# EAGLE design Schematic (EAGLE 9.5.0)
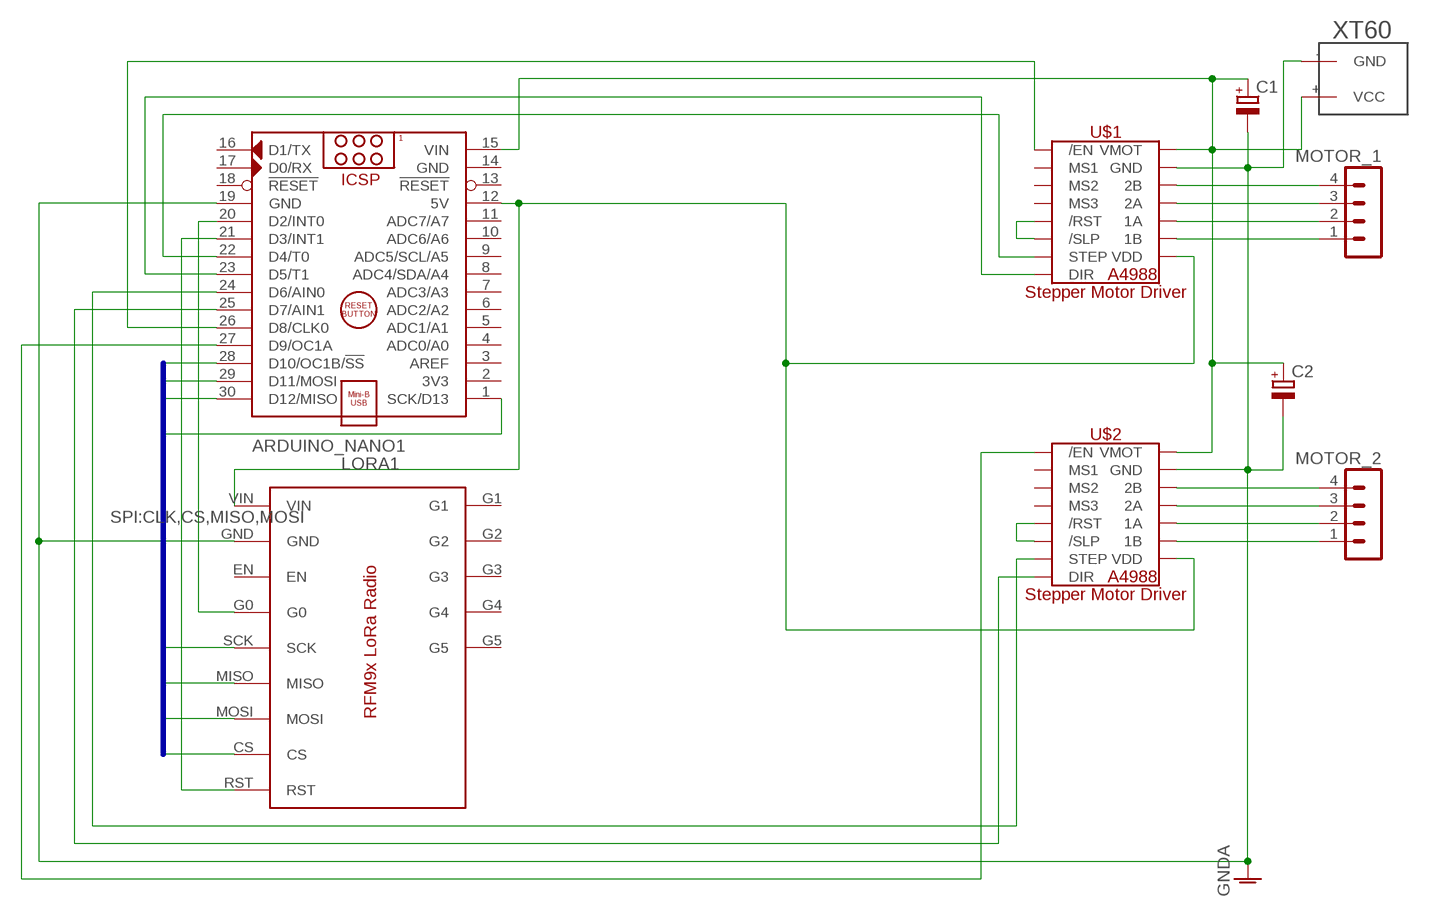
[diagram p0: schematic, sheet 1]

## Parts
ARDUINO_NANO1  ARDUINO_NANO  [ARDUINO_NANO]
C1  CPOL-EUE2,5-6E  [E2,5-6E]
C2  CPOL-EUE2,5-6E  [E2,5-6E]
LORA1  RFM9X_LORA  [RFM9X_LORA]
MOTOR_1  MA04-1  [MA04-1]
MOTOR_2  MA04-1  [MA04-1]
U$1  A4988_STEP  [A4988_STEP]
U$2  A4988_STEP  [A4988_STEP]
U$3  XT60_XT60  [XT60_XT60]

## Nets
CLK: ARDUINO_NANO1.1(SCK/D13) LORA1.SCK
CS: ARDUINO_NANO1.28(D10/OC1B/!SS) LORA1.CS
GNDA: ARDUINO_NANO1.19(GND) C1.- C2.- LORA1.GND U$1.GND U$1.GND2(GND) U$2.GND U$2.GND2(GND) U$3.-(GND)
MISO: ARDUINO_NANO1.30(D12/MISO) LORA1.MISO
MOSI: ARDUINO_NANO1.29(D11/MOSI) LORA1.MOSI
N$1: ARDUINO_NANO1.21(D3/INT1) LORA1.RST
N$2: ARDUINO_NANO1.20(D2/INT0) LORA1.G0
N$3: ARDUINO_NANO1.12(5V) LORA1.VIN U$1.VDD U$2.VDD
N$4: ARDUINO_NANO1.26(D8/CLK0) U$1./EN
N$5: U$1./RST U$1./SLP
N$6: U$2./RST U$2./SLP
N$7: ARDUINO_NANO1.22(D4/T0) U$1.STEP
N$8: ARDUINO_NANO1.23(D5/T1) U$1.DIR
N$9: ARDUINO_NANO1.24(D6/AIN0) U$2.STEP
N$10: ARDUINO_NANO1.25(D7/AIN1) U$2.DIR
N$11: ARDUINO_NANO1.15(VIN) C1.+ C2.+ U$1.VMOT U$2.VMOT U$3.+(VCC)
N$12: ARDUINO_NANO1.27(D9/OC1A) U$2./EN
N$15: MOTOR_1.4 U$1.2B
N$16: MOTOR_1.3 U$1.2A
N$17: MOTOR_1.2 U$1.1A
N$18: MOTOR_1.1 U$1.1B
N$19: MOTOR_2.4 U$2.2B
N$20: MOTOR_2.3 U$2.2A
N$21: MOTOR_2.2 U$2.1A
N$22: MOTOR_2.1 U$2.1B
Unconnected: ARDUINO_NANO1.2(3V3) ARDUINO_NANO1.3(AREF) ARDUINO_NANO1.4(ADC0/A0) ARDUINO_NANO1.5(ADC1/A1) ARDUINO_NANO1.6(ADC2/A2) ARDUINO_NANO1.7(ADC3/A3) ARDUINO_NANO1.8(ADC4/SDA/A4) ARDUINO_NANO1.9(ADC5/SCL/A5) ARDUINO_NANO1.10(ADC6/A6) ARDUINO_NANO1.11(ADC7/A7) ARDUINO_NANO1.13(!RESET) ARDUINO_NANO1.16(D1/TX) ARDUINO_NANO1.17(D0/RX) ARDUINO_NANO1.18(!RESET) LORA1.EN LORA1.G1 LORA1.G2 LORA1.G3 LORA1.G4 LORA1.G5 U$1.MS1 U$1.MS2 U$1.MS3 U$2.MS1 U$2.MS2 U$2.MS3

## Buses
SPI:CLK,CS,MISO,MOSI

## Power pins joined to a net without a drawn wire
GND: ARDUINO_NANO1.14(GND)

## Library data of the parts
ARDUINO_NANO1 = ArduinoNanoV30:ARDUINO_NANO: Arduino Nano V3.0 Module Overview: The Arduino Nano is a small, complete, and breadboard-friendly board based on the ATmega328 (Arduino Nano 3.x) or ATmega168 (Arduino Nano 2.x). It has more or less the same functionality of the Arduino Duemilanove, but in a different package. It lacks only a DC power jack, and works with a Mini-B USB cable instead of a standard one. The Nano was designed and is being produced by Gravitech <http://www.gravitech.us/arna30wiatp.html>. General specifications: Item Value Microcontroller Atmel ATmega168 or ATmega328 Operating Voltage (logic level) 5 V Input Voltage (recommended) 7-12 V Input Voltage (limits) 6-20 V Digital I/O Pins 14 (of which 6 provide PWM output) Analog Input Pins 8 DC Current per I/O Pin 40 mA Flash Memory 16 KB (ATmega168) or 32 KB (ATmega328) of which 2 KB used by bootloader SRAM 1 KB (ATmega168) or 2 KB (ATmega328) EEPROM 512 bytes (ATmega168) or 1 KB (ATmega328) Clock Speed 16 MHz Dimensions (Inches) 0.73" x 1.70" Dimensions (mm) 18mm x 45mm Overall height About 9 mm (not including pins) Weigth 5 g Power: The Arduino Nano can be powered via the Mini-B USB connection, 6-20V unregulated external power supply (pin 30), or 5V regulated external power supply (pin 27). The power source is automatically selected to the highest voltage source. Memory: The ATmega168 has 16 KB of flash memory for storing code (of which 2 KB is used for the bootloader); the ATmega328 has 32 KB, (also with 2 KB used for the bootloader). The ATmega168 has 1 KB of SRAM and 512 bytes of EEPROM (which can be read and written with the EEPROM library); the ATmega328 has 2 KB of SRAM and 1 KB of EEPROM. Input and Output: Each of the 14 digital pins on the Nano can be used as an input or output, using pinMode(), digitalWrite(), and digitalRead() functions. They operate at 5 volts. Each pin can provide or receive a maximum of 40 mA and has an internal pull-up resistor (disconnected by default) of 20-50 kOhms. In addition, some pins have specialized functions. Visit Arduino - ArduinoBoardNano <https://www.arduino.cc/en/Main/ArduinoBoardNano>
C1 C2 = rcl:CPOL-EU: POLARIZED CAPACITOR, European symbol; SPICEPREFIX: C
LORA1 = RFM9x_LoRa:RFM9X_LORA: RFM9x LoRa Radio Transciever https://learn.adafruit.com/adafruit-rfm69hcw-and-rfm96-rfm95-rfm98-lora-packet-padio-breakouts
MOTOR_1 MOTOR_2 = con-lstb:MA04-1: PIN HEADER; OC_FARNELL: unknown; OC_NEWARK: unknown
U$1 U$2 = IC:A4988_STEP
U$3 = XT60_LipoConnector:XT60_XT60: XT60

## Board
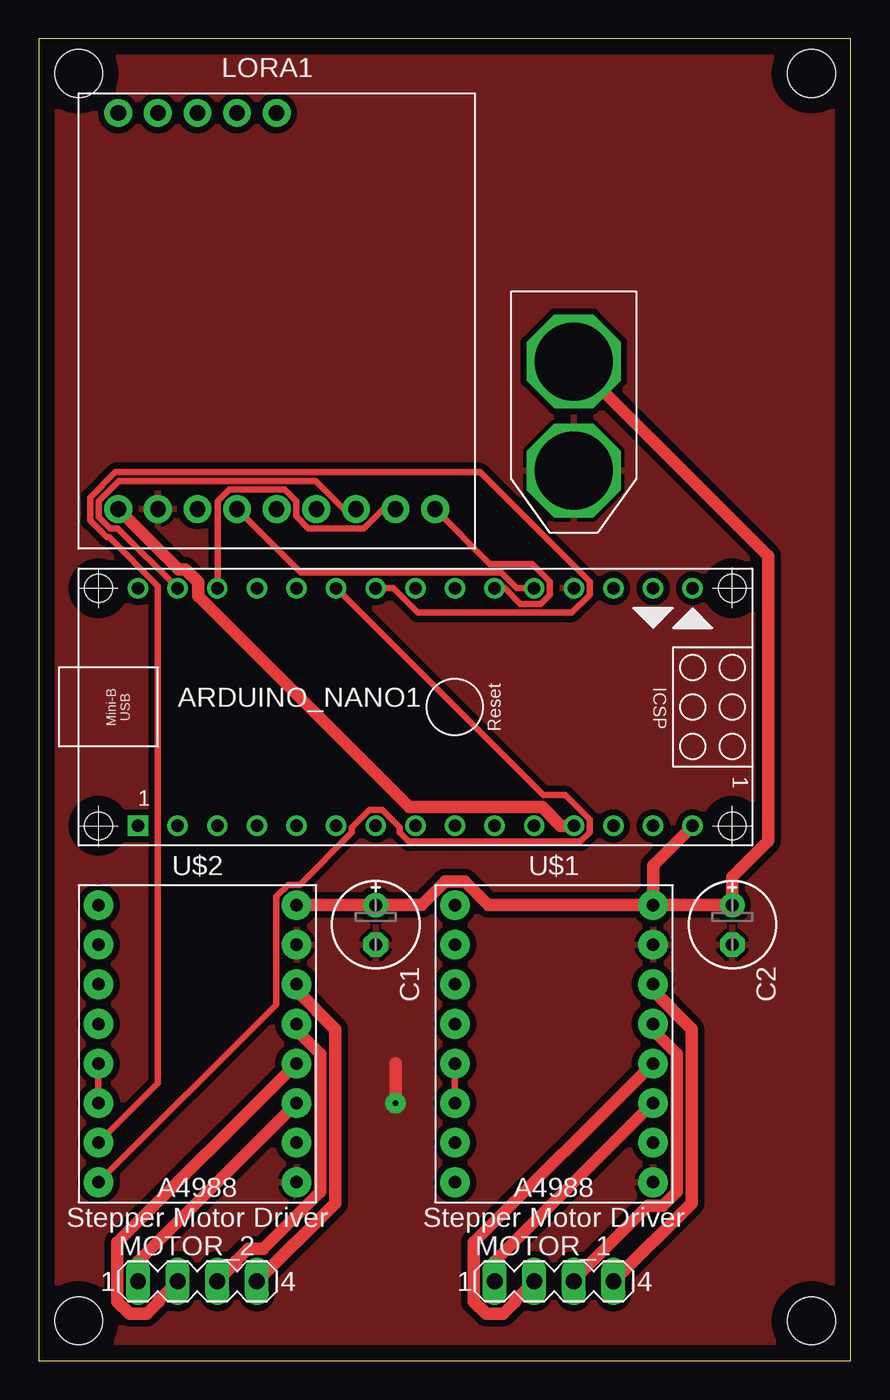
[diagram p1: board, top side]
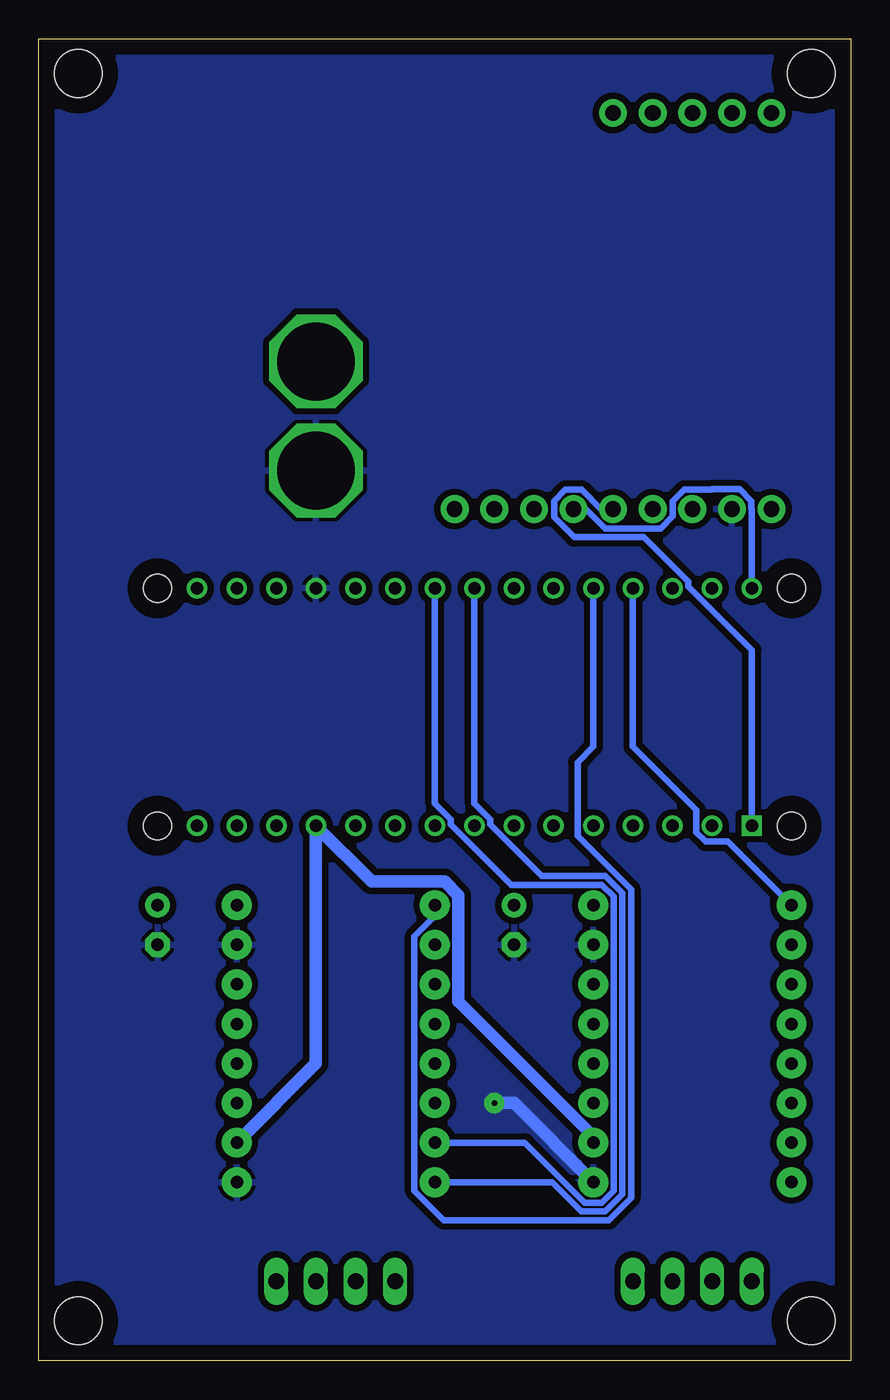
[diagram p2: board, bottom side, seen from below]

Size 52.05 x 84.76 mm. Coordinates in mm from the lower left corner, seen from the top.
Outline: 0,0 52.05,0 52.05,84.76 0,84.76 0,0
Copper layers (1*16): Top 0.035mm / dielectric 1.5mm / Bottom 0.035mm
Design rules "default": minimum track width 6mil, minimum drill 0.35mm, track to track 6mil, track to pad 6mil, pad to pad 6mil, via to via 6mil, smd to smd 6mil, copper to edge 40mil, drill to drill 6mil, minimum pad ring 10mil, minimum via ring 8mil, stop-mask expansion 4mil, vias tented up to drill 0mil, thermal gap 10mil
Holes 3.05 mm at 2.54,82.55 49.53,82.55 49.53,2.54 2.54,2.54

### Footprints (pad centres in the part's own frame; a part is rotated, then mirrored left to right if it is on the bottom)
ARDUINO_NANO = drill 0.8 square: 1 -20.32,-7.62 | drill 0.8: 2 -17.78,-7.62; 3 -15.24,-7.62; 4 -12.7,-7.62; 5 -10.16,-7.62; 6 -7.62,-7.62; 7 -5.08,-7.62; 8 -2.54,-7.62; 9 0,-7.62; 10 2.54,-7.62; 11 5.08,-7.62; 12 7.62,-7.62; 13 10.16,-7.62; 14 12.7,-7.62; 15 15.24,-7.62; 16 15.24,7.62; 17 12.7,7.62; 18 10.16,7.62; 19 7.62,7.62; 20 5.08,7.62; 21 2.54,7.62; 22 0,7.62; 23 -2.54,7.62; 24 -5.08,7.62; 25 -7.62,7.62; 26 -10.16,7.62; 27 -12.7,7.62; 28 -15.24,7.62; 29 -17.78,7.62; 30 -20.32,7.62 | hole 1.778: -22.86,-7.62; -22.86,7.62; 17.78,7.62; 17.78,-7.62
E2,5-6E = drill 0.813 pad 1.575: + -1.27,0 | drill 0.813 pad 1.575 octagon: - 1.27,0
RFM9X_LORA = drill 1 pad 1.778: CS 20.32,2.54; EN 7.62,2.54; G0 10.16,2.54; G1 2.54,27.94; G2 5.08,27.94; G3 7.62,27.94; G4 10.16,27.94; G5 12.7,27.94; GND 5.08,2.54; MISO 15.24,2.54; MOSI 17.78,2.54; RST 22.86,2.54; SCK 12.7,2.54; VIN 2.54,2.54
MA04-1 = drill 1.016 long: 1 -3.81,0; 2 -1.27,0; 3 1.27,0; 4 3.81,0
A4988_STEP = drill 0.8 pad 1.905: 1A 6.35,-1.27; 1B 6.35,-3.81; 2A 6.35,1.27; 2B 6.35,3.81; /EN -6.35,8.89; /RST -6.35,-1.27; /SLP -6.35,-3.81; DIR -6.35,-8.89; GND 6.35,6.35; GND2 6.35,-8.89; MS1 -6.35,6.35; MS2 -6.35,3.81; MS3 -6.35,1.27; STEP -6.35,-6.35; VDD 6.35,-6.35; VMOT 6.35,8.89
XT60_XT60 = drill 5 octagon: + 4.5,0; - 11.5,0

### Placement (x,y rotation side)
ARDUINO_NANO1  26.67,41.91 0 top
C1  21.59,27.94 270 top
C2  44.45,27.94 270 top
LORA1  2.54,52.07 0 top
MOTOR_1  33.02,5.08 0 top
MOTOR_2  10.16,5.08 0 top
U$1  33.02,20.32 0 top
U$2  10.16,20.32 0 top
U$3  34.29,68.58 270 top

### Tracks (layer width: path | path; a pad name or v marks a point on that pad's centre or on a via)
CLK
  Bottom 0.406: ARDUINO_NANO1.1 6.35,45.56 10.42,49.63 10.42,49.95 13.28,52.81 17.74,52.81 19.02,54.09 19.02,55.13 18.3,55.86 17.26,55.86 16.02,54.61 LORA1.SCK
CS
  Top 0.406: LORA1.CS 22.08,54.61 20.84,53.36 17.26,53.36 16.48,54.14 16.48,55.13 15.76,55.86 12.18,55.86 11.46,55.13 11.46,49.55 ARDUINO_NANO1.28
GNDA  (via drill 0.35 pad 1.3)
  Top 0.813: v22.86,16.51 22.86,19.05
  Bottom 0.813: U$2.GND2 21.59,16.51 v22.86,16.51
  pour Bottom (isolate 0.406): 52.07,85.09 52.07,0 0,0 0,85.09
  pour Top (isolate 0.406): 52.07,85.09 52.07,0 0,0 0,85.09
MISO
  Bottom 0.406: LORA1.MISO 17,54.61 15.76,53.36 12.18,53.36 11.4,54.14 11.4,55.13 10.68,55.86 8.91,55.86 8.89,55.88 7.13,55.88 6.38,55.13 6.38,54.64 6.35,54.61 ARDUINO_NANO1.30
MOSI
  Top 0.406: LORA1.MOSI 19.54,54.61 17.74,56.41 5.12,56.41 3.83,55.13 3.83,54.09 4.56,53.36 5.05,53.36 ARDUINO_NANO1.29
N$1
  Top 0.406: LORA1.RST 28.91,51.1 31.61,51.1 32.76,49.95 32.76,49.11 32.17,48.52 30.86,48.52 29.85,49.53 ARDUINO_NANO1.21
N$2
  Top 0.406: LORA1.G0 16.77,50.54 29.63,50.54 30.64,49.53 ARDUINO_NANO1.20
N$3
  Top 0.813: LORA1.VIN 8.95,50.74 9.39,50.74 10.22,49.92 10.22,49.03 23.74,35.5 32.25,35.5 33.47,34.29 ARDUINO_NANO1.12
  Bottom 0.813: U$1.VDD 34.29,19.05 ARDUINO_NANO1.12 30.72,30.72 26.04,30.72 25.16,29.84 25.16,23.02 16.51,14.37 U$2.VDD
N$4
  Bottom 0.406: ARDUINO_NANO1.26 16.51,39.37 17.52,38.36 17.52,33.65 14.08,30.21 14.08,10.42 15.5,9 26.09,9 27.98,10.89 27.98,27.21 26.67,28.52 U$1./EN
N$5
  Top 0.406: U$1./RST U$1./SLP
N$6
  Top 0.406: U$2./RST U$2./SLP
N$7
  Bottom 0.406: ARDUINO_NANO1.22 26.67,35.72 25.66,34.71 25.66,34.39 21.79,30.52 15.97,30.52 15.2,29.75 15.2,10.89 15.97,10.12 17.05,10.12 20.9,13.97 U$1.STEP
N$8
  Bottom 0.406: ARDUINO_NANO1.23 24.13,35.72 23.12,34.71 23.12,34.39 19.8,31.08 15.74,31.08 14.64,29.98 14.64,10.66 15.74,9.56 17.28,9.56 19.15,11.43 U$1.DIR
N$9
  Top 0.406: ARDUINO_NANO1.24 22.7,49.53 24.27,47.96 34.15,47.96 35.3,49.11 35.3,49.95 28.28,56.97 4.89,56.97 3.28,55.36 3.28,53.86 4.33,52.81 4.5,52.81 7.62,49.69 7.62,17.78 U$2.STEP
N$10
  Top 0.406: U$2.DIR 15.2,22.82 15.2,29.75 15.97,30.52 16.71,30.52 20.06,33.87 20.06,34.19 21.17,35.3 22.01,35.3 23.12,34.19 23.12,33.87 23.71,33.28 34.71,33.28 35.3,33.87 35.3,34.71 33.74,36.27 32.32,36.27 ARDUINO_NANO1.25
N$11
  Top 0.813: U$3.+ 46.76,51.61 46.76,33.33 44.45,31.02 C2.+ U$1.VMOT | U$1.VMOT 28.81,29.21 27.3,30.72 26.04,30.72 24.53,29.21 C1.+ U$2.VMOT | U$1.VMOT 39.37,31.75 ARDUINO_NANO1.15
N$12
  Bottom 0.406: ARDUINO_NANO1.27 13.97,39.37 9.9,35.3 9.9,33.87 9.31,33.28 7.88,33.28 U$2./EN
N$15
  Top 0.813: U$1.2B 39.37,23.73 41.85,21.25 41.85,10.1 MOTOR_1.4
N$16
  Top 0.813: MOTOR_1.3 34.29,5.17 39.04,9.92 40,9.92 40.88,10.8 40.88,19.68 39.37,21.19 U$1.2A
N$17
  Top 0.813: MOTOR_1.2 30.53,3.86 30.53,3.77 29.76,3 28.66,3 27.89,3.77 27.89,7.57 U$1.1A
N$18
  Top 0.813: U$1.1B 29.21,6.35 MOTOR_1.1
N$19
  Top 0.813: U$2.2B 16.51,23.73 18.99,21.25 18.99,10.1 MOTOR_2.4
N$20
  Top 0.813: MOTOR_2.3 12.65,6.3 12.65,6.39 13.42,7.16 14.38,7.16 18.02,10.8 18.02,19.68 16.51,21.19 U$2.2A
N$21
  Top 0.813: MOTOR_2.2 7.67,3.86 7.67,3.77 6.9,3 5.8,3 5.03,3.77 5.03,7.57 U$2.1A
N$22
  Top 0.813: U$2.1B 6.35,6.35 MOTOR_2.1